# EAGLE design 8_Relay_Buzz_SCT013_75 (EAGLE 7.7.0)
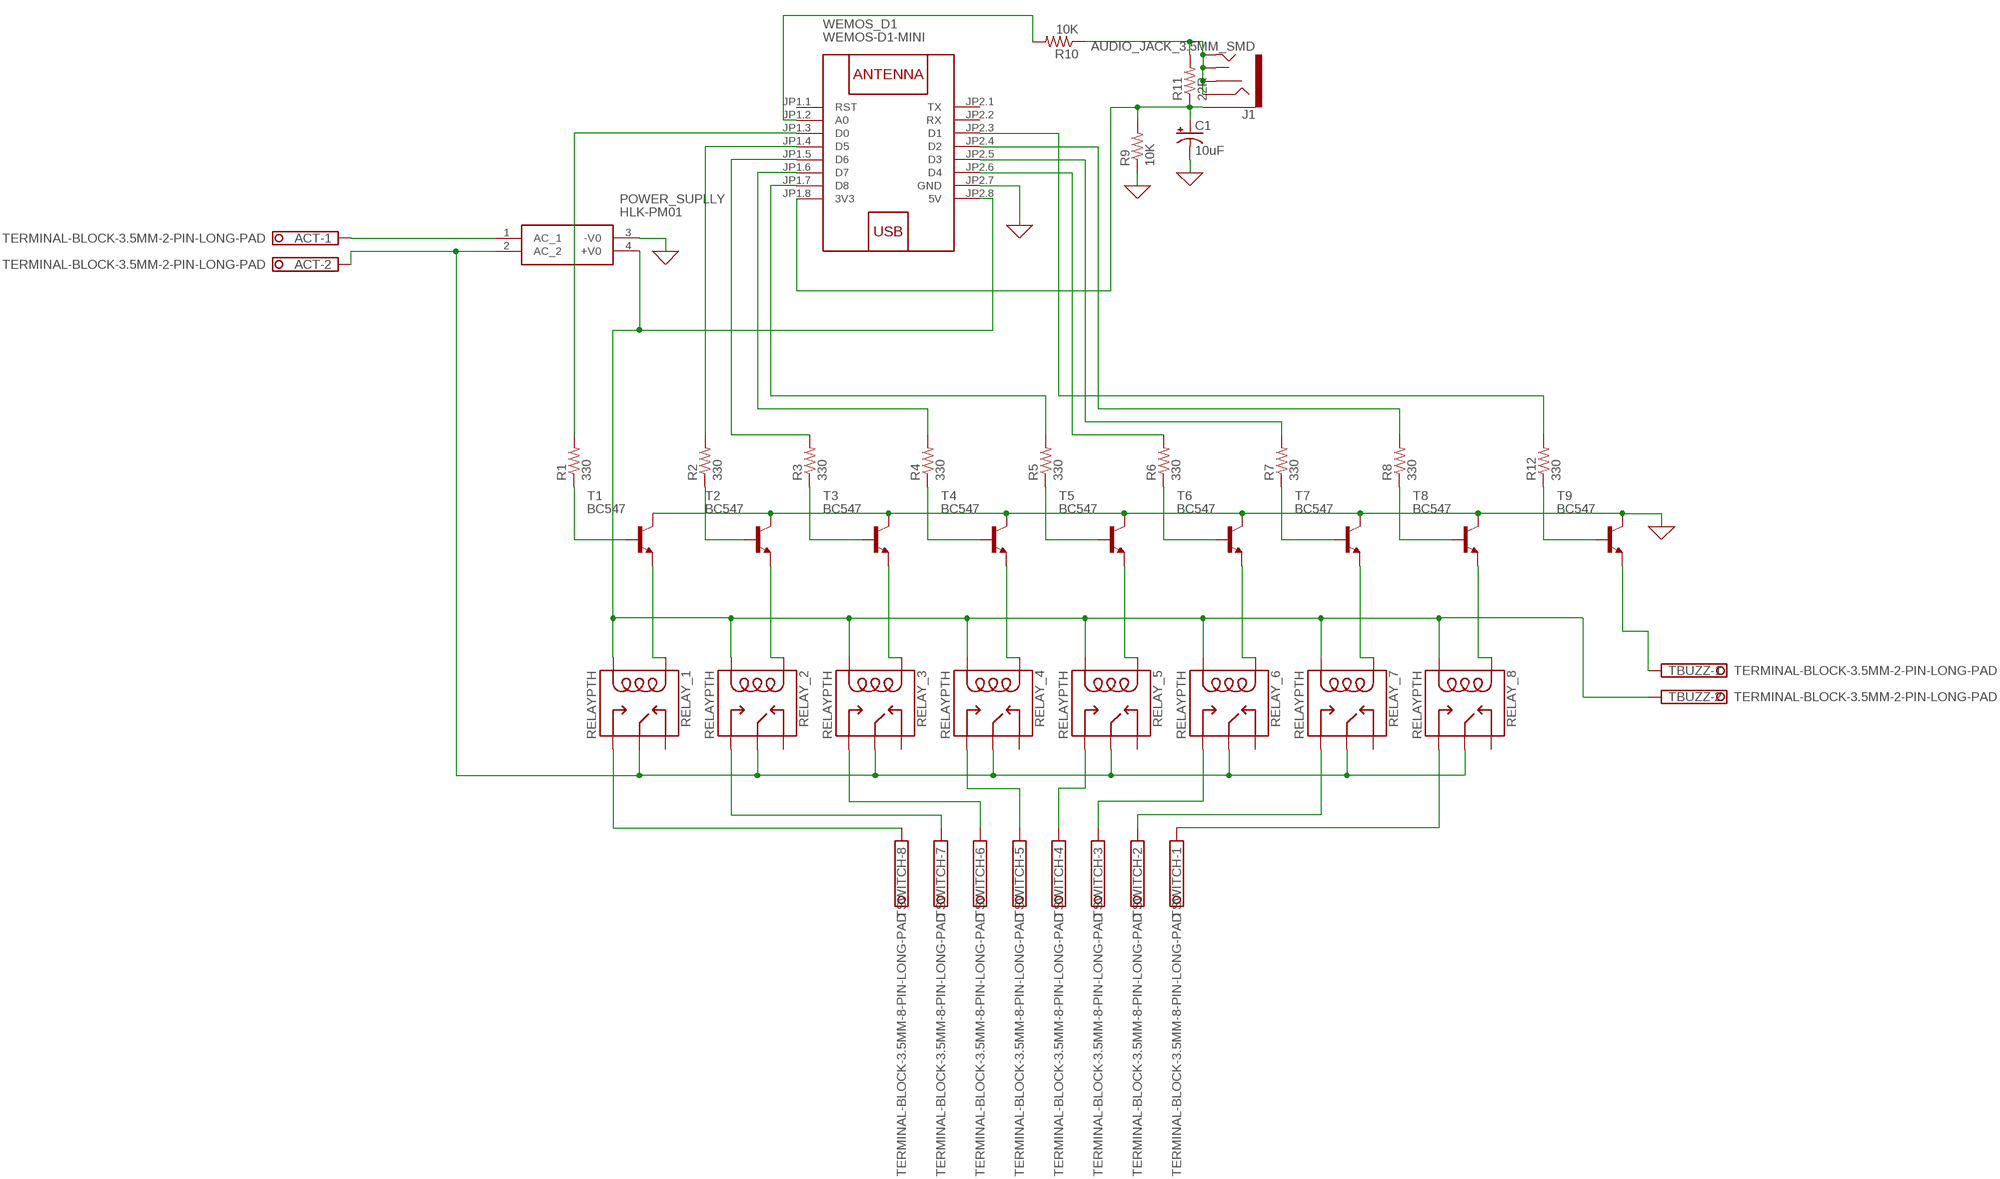
[diagram p0: schematic, sheet 1]

## Parts
ACT  TERMINAL-BLOCK-3.5MM-2-PIN-LONG-PAD  [TERMINAL-BLOCK-2-PIN-3.5MM-LONG-PAD]
C1  10uF  CPOL-USE3.5-8  [E3,5-8]
J1  AUDIO_JACK_3.5MM_SMD  [AUDIO-JACK-3.5MM-SMD]
POWER_SUPLLY  HLK-PM01  [HLKPM01]
R1  330  R-US_0207/5V  [0207/5V]
R2  330  R-US_0207/5V  [0207/5V]
R3  330  R-US_0207/5V  [0207/5V]
R4  330  R-US_0207/5V  [0207/5V]
R5  330  R-US_0207/5V  [0207/5V]
R6  330  R-US_0207/5V  [0207/5V]
R7  330  R-US_0207/5V  [0207/5V]
R8  330  R-US_0207/5V  [0207/5V]
R9  10K  R-US_0207/5V  [0207/5V]
R10  10K  R-US_0207/5V  [0207/5V]
R11  22R  R-US_0207/5V  [0207/5V]
R12  330  R-US_0207/5V  [0207/5V]
RELAY_1  RELAYPTH  [SRD-05VDC-SL-C]
RELAY_2  RELAYPTH  [SRD-05VDC-SL-C]
RELAY_3  RELAYPTH  [SRD-05VDC-SL-C]
RELAY_4  RELAYPTH  [SRD-05VDC-SL-C]
RELAY_5  RELAYPTH  [SRD-05VDC-SL-C]
RELAY_6  RELAYPTH  [SRD-05VDC-SL-C]
RELAY_7  RELAYPTH  [SRD-05VDC-SL-C]
RELAY_8  RELAYPTH  [SRD-05VDC-SL-C]
T1  BC547  [TO92]
T2  BC547  [TO92]
T3  BC547  [TO92]
T4  BC547  [TO92]
T5  BC547  [TO92]
T6  BC547  [TO92]
T7  BC547  [TO92]
T8  BC547  [TO92]
T9  BC547  [TO92]
TBUZZ  TERMINAL-BLOCK-3.5MM-2-PIN-LONG-PAD  [TERMINAL-BLOCK-2-PIN-3.5MM-LONG-PAD]
TSWITCH  TERMINAL-BLOCK-3.5MM-8-PIN-LONG-PAD  [TERMINAL-BLOCK-8-PIN-3.5MM-LONG-PAD]
WEMOS_D1  WEMOS-D1-MINI  [WEMOS-D1-MINI]

## Nets
0: C1.- POWER_SUPLLY.3(-V0) R9.1 T1.3(C) T2.3(C) T3.3(C) T4.3(C) T5.3(C) T6.3(C) T7.3(C) T8.3(C) T9.3(C) WEMOS_D1.JP2.7(GND) ; supply symbol labelled GND
3V: C1.+ J1.SLEEVE R9.2 R11.1 WEMOS_D1.JP1.8(3V3)
5V: POWER_SUPLLY.4(+V0) RELAY_1.COIL0 RELAY_2.COIL0 RELAY_3.COIL0 RELAY_4.COIL0 RELAY_5.COIL0 RELAY_6.COIL0 RELAY_7.COIL0 RELAY_8.COIL0 TBUZZ.2 WEMOS_D1.JP2.8(5V)
A0: R10.2 WEMOS_D1.JP1.2(A0)
AC+: ACT.2 POWER_SUPLLY.2(AC_2) RELAY_1.SWCOMMON RELAY_2.SWCOMMON RELAY_3.SWCOMMON RELAY_4.SWCOMMON RELAY_5.SWCOMMON RELAY_6.SWCOMMON RELAY_7.SWCOMMON RELAY_8.SWCOMMON
AC-: ACT.1 POWER_SUPLLY.1(AC_1)
BBZ: R12.1 T9.2(B)
BR1: R1.1 T1.2(B)
BR2: R2.1 T2.2(B)
BR3: R3.1 T3.2(B)
BR4: R4.1 T4.2(B)
BR5: R5.1 T5.2(B)
BR6: R6.1 T6.2(B)
BR7: R7.1 T7.2(B)
BR8: R8.1 T8.2(B)
D0: R1.2 WEMOS_D1.JP1.3(D0)
D1: R12.2 WEMOS_D1.JP2.3(D1)
D2: R8.2 WEMOS_D1.JP2.4(D2)
D3: R7.2 WEMOS_D1.JP2.5(D3)
D4: R6.2 WEMOS_D1.JP2.6(D4)
D5: R2.2 WEMOS_D1.JP1.4(D5)
D6: R3.2 WEMOS_D1.JP1.5(D6)
D7: R4.2 WEMOS_D1.JP1.6(D7)
D8: R5.2 WEMOS_D1.JP1.7(D8)
EBZ: T9.1(E) TBUZZ.1
ER1: RELAY_1.COIL1 T1.1(E)
ER2: RELAY_2.COIL1 T2.1(E)
ER3: RELAY_3.COIL1 T3.1(E)
ER4: RELAY_4.COIL1 T4.1(E)
ER5: RELAY_5.COIL1 T5.1(E)
ER6: RELAY_6.COIL1 T6.1(E)
ER7: RELAY_7.COIL1 T7.1(E)
ER8: RELAY_8.COIL1 T8.1(E)
SA0: J1.RING J1.RSH J1.TIP J1.TSH R10.1 R11.2
SR1: RELAY_1.SWOPEN TSWITCH.8
SR2: RELAY_2.SWOPEN TSWITCH.7
SR3: RELAY_3.SWOPEN TSWITCH.6
SR4: RELAY_4.SWOPEN TSWITCH.5
SR5: RELAY_5.SWOPEN TSWITCH.4
SR6: RELAY_6.SWOPEN TSWITCH.3
SR7: RELAY_7.SWOPEN TSWITCH.2
SR8: RELAY_8.SWOPEN TSWITCH.1
Unconnected: RELAY_1.SWCLOSED(SWCLOSE) RELAY_2.SWCLOSED(SWCLOSE) RELAY_3.SWCLOSED(SWCLOSE) RELAY_4.SWCLOSED(SWCLOSE) RELAY_5.SWCLOSED(SWCLOSE) RELAY_6.SWCLOSED(SWCLOSE) RELAY_7.SWCLOSED(SWCLOSE) RELAY_8.SWCLOSED(SWCLOSE) WEMOS_D1.JP1.1(RST) WEMOS_D1.JP2.1(TX) WEMOS_D1.JP2.2(RX)

## Library data of the parts
ACT TBUZZ = Rembrandt:TERMINAL-BLOCK-3.5MM-2-PIN: Terminal Block 3.5mm Pitch: 3,5 mm Number of pins: 2 Created by Rembrandt Electronics www.rembrandtelectronics.com
C1 = rcl:CPOL-US: POLARIZED CAPACITOR, American symbol; SPICEPREFIX: C
J1 = SparkFun-Connectors:AUDIO_JACK_3.5MM: Audio Jack 3.5mm variants of PTH and SMT stereo audio jack with bypass switches. SparkFun Products: SparkFun SparkPunk Sound Kit <[https://www.sparkfun.com/products/11177]> - PTH MP3 Trigger <https://www.sparkfun.com/products/13720> -3.5mm SMD SparkFun PicoBoard <https://www.sparkfun.com/products/11888>- 2.5mm SMD; PROD_ID: CONN-10353
POWER_SUPLLY = HLK-PM01:HLK-PM01: Ultra-compact power module Source: Datasheet <https://datasheet.lcsc.com/szlcsc/1906201102_HI-LINK-HLK-PM03_C209904.pdf>; AVAILABILITY: Unavailable; MF: Hi-link; MP: hlk-pm01; PACKAGE: Package; PRICE: None
R1-R12 = adafruit:R-US_: RESISTOR, American symbol
RELAY_1-RELAY_8 = SRD-05VDC-SL-C:RELAY: SPDT relay (COM-00101)
T1-T9 = transistor:BC547: NPN TRANSISTOR
TSWITCH = Rembrandt:TERMINAL-BLOCK-3.5MM-8-PIN: Terminal Block 3.5mm Pitch: 3,5 mm Number of pins: 8 Created by Rembrandt Electronics www.rembrandtelectronics.com
WEMOS_D1 = diy-modules:WEMOS-D1-MINI: WEMOS D1 mini: Mini Wi-Fi Board based on ESP-8266 device More details can be found here: https://www.wemos.cc/product/d1-mini.html Click here to find device on ebay.com <http://www.ebay.com/sch/wemos+d1+mini+nodemcu>

## Board
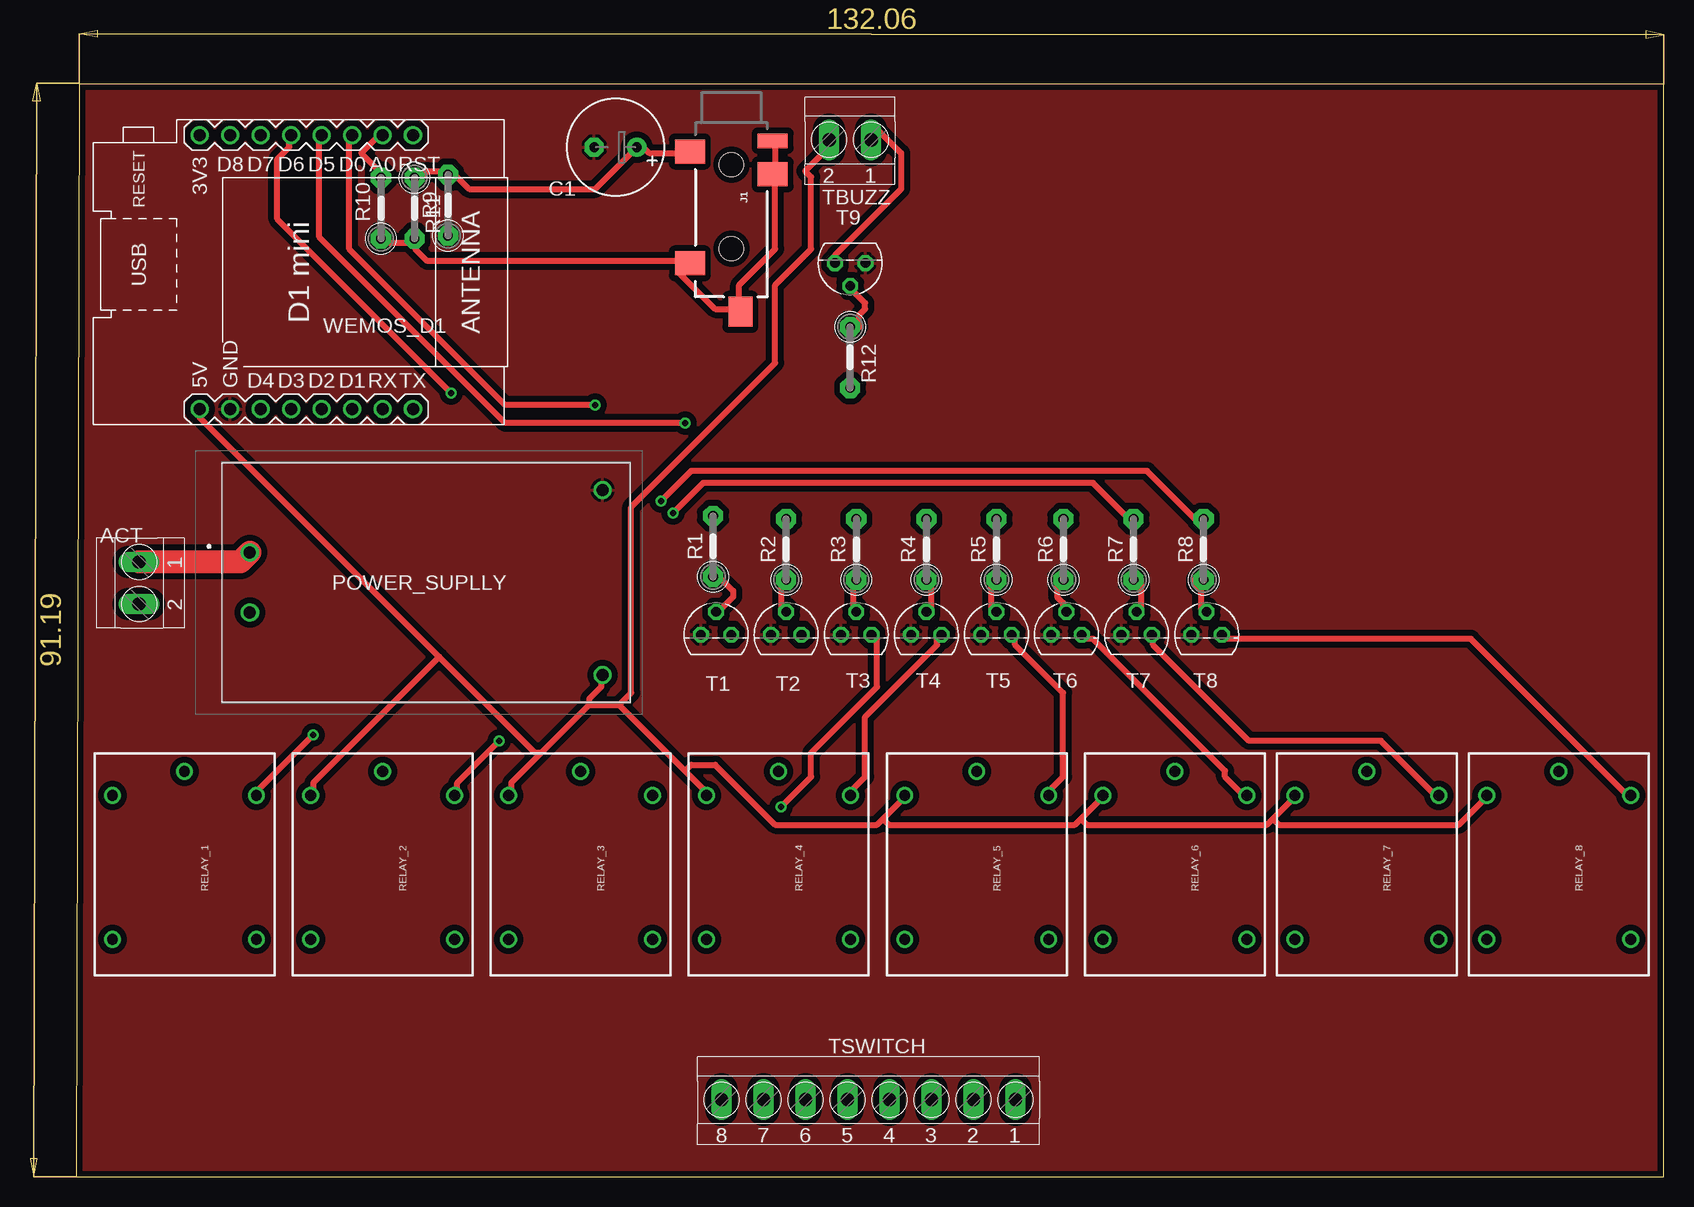
[diagram p1: board, top side]
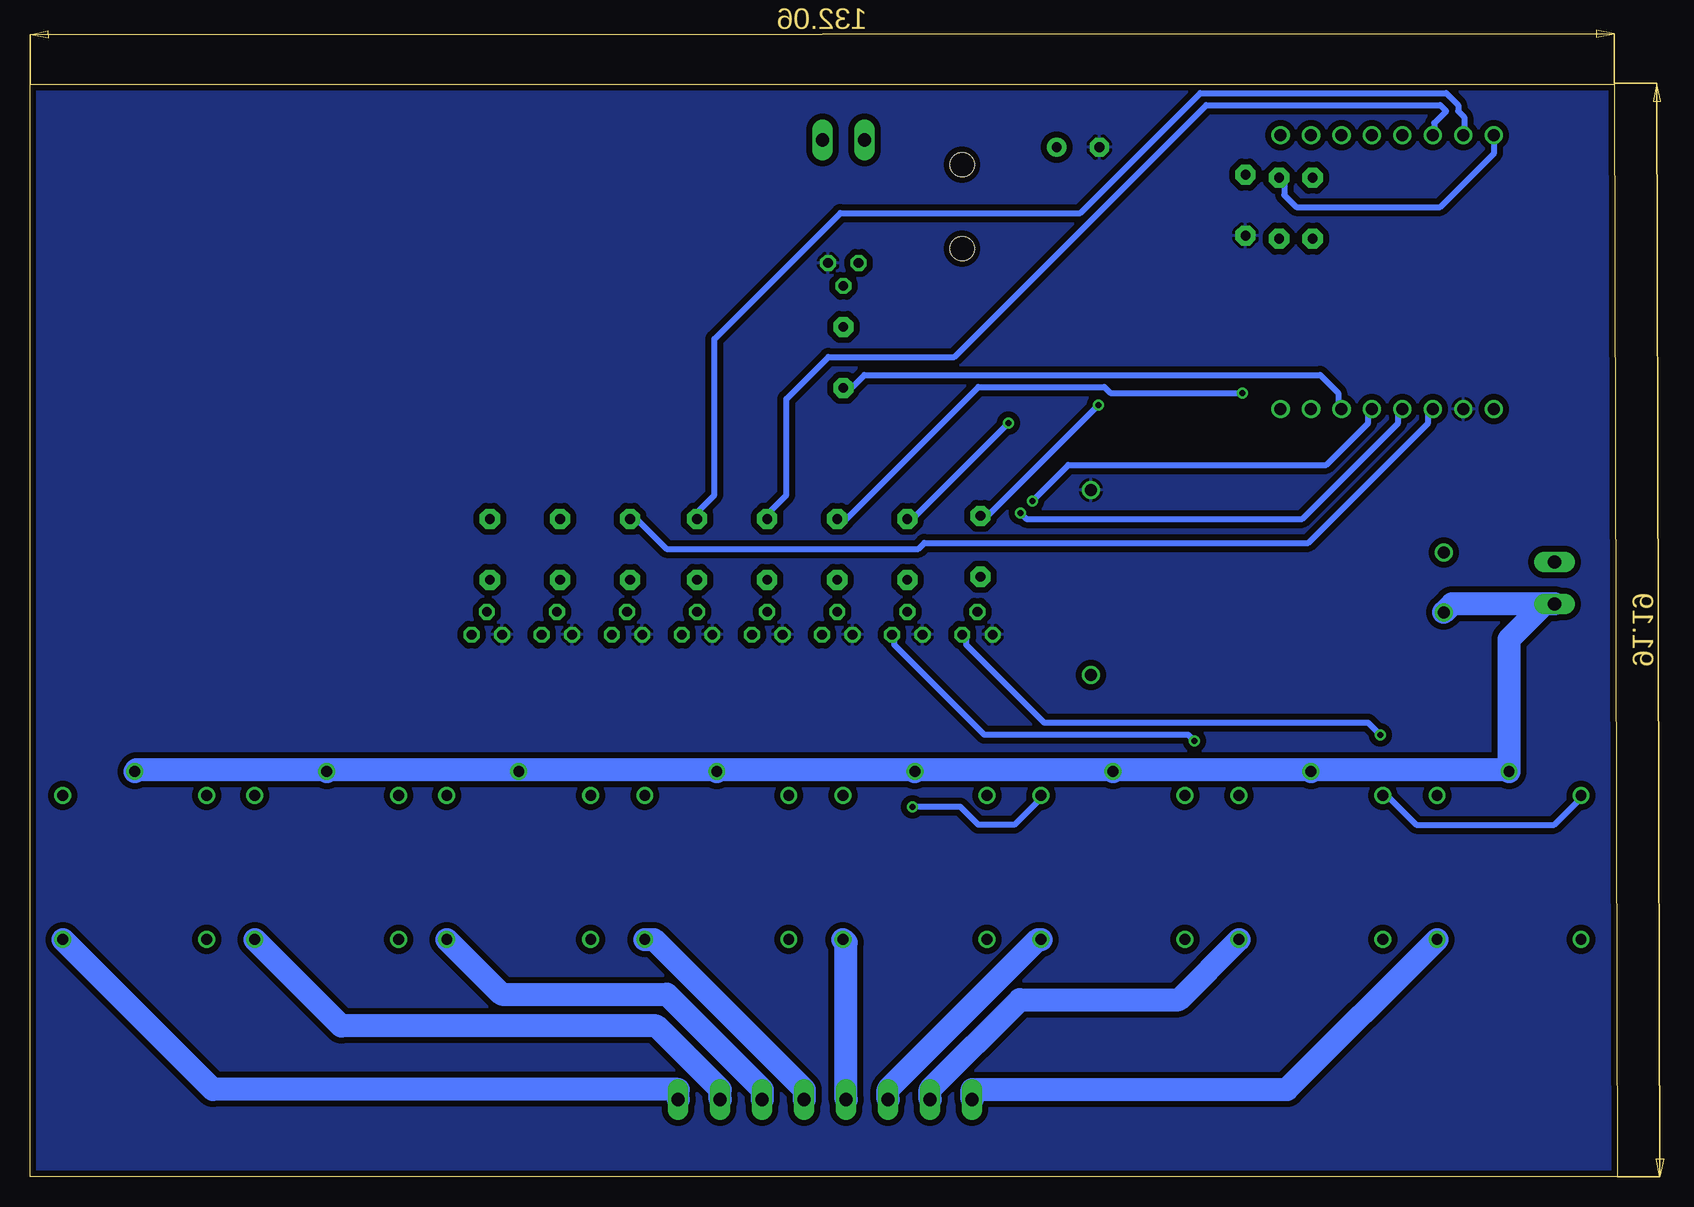
[diagram p2: board, bottom side, seen from below]

Size 132.31 x 91.11 mm. Coordinates in mm from the lower left corner, seen from the top.
Outline: 0,0 132.31,0 132.31,91.11 0.25,91.11 0,0
Copper layers (1*16): Top 0.035mm / dielectric 1.5mm / Bottom 0.035mm
Design rules "default *": minimum track width 0.5mm, minimum drill 0.5mm, track to track 0.5mm, track to pad 0.5mm, pad to pad 0.5mm, via to via 0.5mm, smd to smd 0.5mm, copper to edge 0.5mm, drill to drill 0.5mm, minimum pad ring 10mil, minimum via ring 8mil, stop-mask expansion 0.5mm, vias tented up to drill 0mil, thermal gap 10mil

### Footprints (pad centres in the part's own frame; a part is rotated, then mirrored left to right if it is on the bottom)
TERMINAL-BLOCK-2-PIN-3.5MM-LONG-PAD = drill 1.1 pad 1.7 long: 1 -1.75,-0.1; 2 1.75,-0.1
E3,5-8 = drill 0.813 pad 1.6: + -1.778,0 | drill 0.813 pad 1.6 octagon: - 1.778,0
AUDIO-JACK-3.5MM-SMD = smd 2 x 2.5: RING 4.3,3.45; SLEEVE 2.4,-3.45; TIP 11.7,-3.45 | smd 1.2 x 2.5: RSH 1.5,3.45 | smd 2.5 x 2: TSH 15.75,0.75 | hole 2: 3.5,0; 10.5,0
HLKPM01 = drill 1 pad 1.5: 1 0,0; 2 0,-5; 3 29.4,5.2; 4 29.4,-10.2
0207/5V = drill 0.813 pad 1.676 octagon: 1 -2.54,0; 2 2.54,0
SRD-05VDC-SL-C = drill 0.9: COIL0 -5.39,-6.12; COIL1 -5.39,5.88; SWCLOSED 6.61,-6.12; SWCOMMON -7.39,-0.12; SWOPEN 6.61,5.88
TO92 = drill 0.813 octagon: 1 1.27,0; 2 0,1.905; 3 -1.27,0
TERMINAL-BLOCK-8-PIN-3.5MM-LONG-PAD = drill 1.1 pad 1.7 long: 1 -12.25,-0.1; 2 -8.75,-0.1; 3 -5.25,-0.1; 4 -1.75,-0.1; 5 1.75,-0.1; 6 5.25,-0.1; 7 8.75,-0.1; 8 12.25,-0.1
WEMOS-D1-MINI = drill 1: JP1.1 -11.43,9.525; JP1.2 -11.43,6.985; JP1.3 -11.43,4.445; JP1.4 -11.43,1.905; JP1.5 -11.43,-0.635; JP1.6 -11.43,-3.175; JP1.7 -11.43,-5.715; JP1.8 -11.43,-8.255; JP2.1 11.43,9.525; JP2.2 11.43,6.985; JP2.3 11.43,4.445; JP2.4 11.43,1.905; JP2.5 11.43,-0.635; JP2.6 11.43,-3.175; JP2.7 11.43,-5.715; JP2.8 11.43,-8.255

### Placement (x,y rotation side)
ACT  5.33,49.53 270 top
C1  44.96,85.85 180 top
J1  54.61,87.88 270 top
POWER_SUPLLY  14.48,52.07 0 top
R1  53.09,52.58 90 top
R2  59.18,52.32 90 top
R3  65.02,52.32 90 top
R4  70.87,52.32 90 top
R5  76.71,52.32 90 top
R6  82.3,52.32 90 top
R7  88.14,52.32 90 top
R8  93.98,52.32 90 top
R9  30.99,81.03 90 top
R10  25.4,80.77 90 top
R11  28.19,80.77 270 top
R12  64.52,68.33 270 top
RELAY_1  9.14,26.42 270 top
RELAY_2  25.65,26.42 270 top
RELAY_3  42.16,26.42 270 top
RELAY_4  58.67,26.42 270 top
RELAY_5  75.18,26.42 270 top
RELAY_6  91.69,26.42 270 top
RELAY_7  107.7,26.42 270 top
RELAY_8  123.7,26.42 270 top
T1  53.34,45.21 0 top
T2  59.18,45.21 0 top
T3  65.02,45.21 0 top
T4  70.87,45.21 0 top
T5  76.71,45.21 0 top
T6  82.55,45.21 0 top
T7  88.39,45.21 0 top
T8  94.23,45.21 0 top
T9  64.52,76.2 180 top
TBUZZ  64.52,86.36 180 top
TSWITCH  66.04,6.35 180 top
WEMOS_D1  18.54,75.44 270 top

### Tracks (layer width: path | path; a pad name or v marks a point on that pad's centre or on a via)
0
  pour Bottom: 0.25,91.19 132.33,91.19 132.33,0 0.25,0
  pour Top: 0.25,91.19 132.33,91.19 132.33,0 0.25,0
3V
  Top 0.5: J1.SLEEVE 50.75,85.36 47.75,85.36 47.25,85.86 46.75,85.86 C1.+ 46.25,85.36 43.25,82.36 32.75,82.36 31.25,83.86 R9.2 30.75,83.86 29.25,83.86 28.25,82.86 R11.1
  Bottom 0.5: WEMOS_D1.JP1.8 10.25,86.86 10.25,85.36 14.75,80.86 26.75,80.86 27.75,81.86 27.75,82.86 R11.1
5V
  Top 0.5: 42.75,39.36 38.75,35.36 | 38.75,35.36 36.25,32.86 36.25,31.86 RELAY_3.COIL0 | 42.75,39.36 42.75,39.86 43.75,40.86 43.75,41.86 POWER_SUPLLY.4 | 45.25,39.36 50.75,33.86 | 50.75,33.86 52.25,32.36 52.25,31.86 RELAY_4.COIL0 | 42.75,39.36 45.25,39.36 | 67.25,29.86 66.75,29.36 58.25,29.36 53.25,34.36 51.25,34.36 50.75,33.86 | 67.25,29.86 68.75,31.36 RELAY_5.COIL0 | 83.75,29.86 83.25,29.36 67.75,29.36 67.25,29.86 | 83.75,29.86 85.25,31.36 RELAY_6.COIL0 | 99.75,29.86 99.25,29.36 84.25,29.36 83.75,29.86 | 99.75,29.86 101.25,31.36 RELAY_7.COIL0 | 99.75,29.86 100.25,29.36 115.25,29.36 117.25,31.36 RELAY_8.COIL0 | 30.25,43.36 38.25,35.36 38.75,35.36 | 30.25,43.36 10.25,63.36 10.25,63.86 WEMOS_D1.JP2.8 | 45.25,39.36 46.25,40.36 46.25,55.86 58.25,67.86 58.25,74.36 61.25,77.36 61.25,83.36 60.75,83.86 62.75,85.86 62.75,86.36 TBUZZ.2 | 30.25,43.36 19.75,32.86 19.75,31.86 RELAY_2.COIL0
  Bottom 0.5: RELAY_1.COIL0 3.25,31.36 5.25,29.36 16.75,29.36 19.25,31.86 RELAY_2.COIL0
A0
  Top 0.5: WEMOS_D1.JP1.2 25.25,86.86 23.75,85.36 25.75,83.36 R10.2
AC+
  Bottom 0.5: RELAY_6.SWCOMMON 91.75,33.86 91.75,33.96
  Bottom 1.905: 6.08,47.78 9.02,44.84 RELAY_1.SWCOMMON 9.18,33.96 25.38,33.96 RELAY_2.SWCOMMON 25.69,33.96 41.89,33.96 RELAY_3.SWCOMMON 42.2,33.96 58.4,33.96 RELAY_4.SWCOMMON 58.71,33.96 74.91,33.96 RELAY_5.SWCOMMON 75.22,33.96 91.75,33.96 107.42,33.96 RELAY_7.SWCOMMON 107.73,33.96 123.42,33.96 RELAY_8.SWCOMMON | ACT.2 6.08,47.78 | 6.08,47.78 13.77,47.78 POWER_SUPLLY.2
AC-
  Top 1.905: POWER_SUPLLY.1 13.69,51.28 ACT.1
BBZ
  Top 0.5: T9.2 64.75,73.86 65.75,72.86 65.75,72.36 65.25,71.86 65.25,70.86 64.75,70.36 64.25,70.86 R12.1
BR1
  Top 0.5: T1.2 53.75,47.36 54.75,48.36 54.75,48.86 53.25,50.36 R1.1
BR2
  Top 0.5: T2.2 58.75,47.36 58.75,49.36 R2.1
BR3
  Top 0.5: T3.2 64.75,47.36 64.75,49.36 R3.1
BR4
  Top 0.5: T4.2 71.25,47.36 71.25,49.36 R4.1
BR5
  Top 0.5: T5.2 76.25,47.36 76.25,49.36 R5.1
BR6
  Top 0.5: T6.2 82.25,47.36 82.25,47.86 81.75,48.36 81.75,49.86 82.25,49.86 R6.1
BR7
  Top 0.5: T7.2 88.75,47.36 88.75,49.86 88.25,50.36 87.75,49.86 R7.1
BR8
  Top 0.5: T8.2 93.75,47.36 93.75,48.86 93.25,49.36 93.25,49.86 93.75,50.36 94.25,49.86 R8.1
D0  (via drill 0.5)
  Top 0.5: v43.25,64.36 35.75,64.36 22.75,77.36 22.75,86.86 WEMOS_D1.JP1.3
  Bottom 0.5: v43.25,64.36 52.75,54.86 R1.2
D1
  Bottom 0.5: WEMOS_D1.JP2.3 23.25,64.36 23.25,65.36 24.75,66.86 62.75,66.86 63.75,65.86 64.25,66.36 64.75,66.36 64.75,65.86 R12.2
D2  (via drill 0.5)
  Top 0.5: v48.75,56.36 51.25,58.86 89.25,58.86 93.75,54.36 94.25,54.86 R8.2
  Bottom 0.5: v48.75,56.36 45.75,59.36 24.25,59.36 20.75,62.86 20.75,63.86 WEMOS_D1.JP2.4
D3  (via drill 0.5)
  Top 0.5: v49.75,55.36 52.25,57.86 84.75,57.86 87.75,54.86 R7.2
  Bottom 0.5: v49.75,55.36 49.25,54.86 26.25,54.86 18.25,62.86 18.25,63.86 WEMOS_D1.JP2.5
D4
  Bottom 0.5: WEMOS_D1.JP2.6 15.75,63.86 15.75,62.86 25.75,52.86 57.75,52.86 58.25,52.36 79.25,52.36 82.25,55.36 R6.2
D5  (via drill 0.5)
  Top 0.5: v50.75,62.86 35.75,62.86 20.25,78.36 20.25,86.86 WEMOS_D1.JP1.4
  Bottom 0.5: v50.75,62.86 58.75,54.86 R2.2
D6  (via drill 0.5)
  Top 0.5: v31.25,65.36 16.75,79.86 16.75,84.86 17.75,85.86 17.75,86.86 WEMOS_D1.JP1.5
  Bottom 0.5: v31.25,65.36 42.25,65.36 42.75,65.86 53.25,65.86 64.75,54.36 65.25,54.86 R3.2
D7
  Bottom 0.5: WEMOS_D1.JP1.6 15.25,87.36 15.25,87.86 14.25,88.86 14.75,89.36 34.25,89.36 55.25,68.36 65.75,68.36 69.25,64.86 69.25,56.86 70.75,55.36 R4.2
D8
  Bottom 0.5: WEMOS_D1.JP1.7 12.75,87.36 12.75,88.36 13.25,88.86 13.25,89.36 14.25,90.36 34.75,90.36 44.75,80.36 64.75,80.36 75.25,69.86 75.25,56.86 76.75,55.36 R5.2
EBZ
  Top 0.5: T9.1 63.25,76.36 63.25,76.86 68.75,82.36 68.75,85.36 66.75,87.36 66.25,86.86 TBUZZ.1
ER1  (via drill 0.5)
  Top 0.5: v19.75,36.86 14.75,31.86 RELAY_1.COIL1
  Bottom 0.5: v19.75,36.86 20.75,37.86 47.75,37.86 54.25,44.36 54.25,44.86 T1.1
ER2  (via drill 0.5)
  Top 0.5: v35.25,36.36 31.75,32.86 31.75,31.86 RELAY_2.COIL1
  Bottom 0.5: v35.25,36.36 35.75,36.86 52.75,36.86 60.25,44.36 60.25,44.86 T2.1
ER3  (via drill 0.5)
  Top 0.5: v58.75,30.86 61.25,33.36 61.25,35.36 66.75,40.86 66.75,44.86 T3.1
  Bottom 0.5: v58.75,30.86 54.75,30.86 53.25,29.36 50.25,29.36 48.25,31.36 RELAY_3.COIL1
ER4
  Top 0.5: T4.1 71.75,44.86 71.75,44.36 65.75,38.36 65.75,33.36 64.25,31.86 RELAY_4.COIL1
ER5
  Top 0.5: T5.1 78.25,44.86 78.25,44.36 82.25,40.36 82.25,33.36 80.75,31.86 RELAY_5.COIL1
ER6
  Top 0.5: T6.1 84.25,44.86 84.75,44.86 95.75,33.86 95.75,33.36 97.25,31.86 RELAY_6.COIL1
ER7
  Top 0.5: T7.1 89.75,44.86 89.75,44.36 97.75,36.36 108.75,36.36 113.25,31.86 RELAY_7.COIL1
ER8
  Top 0.5: T8.1 95.75,44.86 116.25,44.86 129.25,31.86 RELAY_8.COIL1
SA0
  Top 0.5: R10.1 25.75,77.86 27.75,77.86 R11.2 28.25,77.86 28.25,77.36 29.25,76.36 50.75,76.36 | J1.RSH 58.25,86.36 58.25,83.86 J1.RING 58.25,83.36 58.25,77.36 55.25,74.36 55.25,72.36 | 55.25,72.36 53.25,72.36 50.25,75.36 50.25,75.86 50.75,76.36 | 55.25,72.36 J1.TSH | 50.75,76.36 J1.TIP
SR1
  Bottom 1.905: TSWITCH.8 53.79,7.3 27.53,7.3 RELAY_1.SWOPEN
SR2
  Bottom 1.905: TSWITCH.7 57.29,7.3 49.81,14.78 36.56,14.78 RELAY_2.SWOPEN
SR3
  Bottom 1.905: TSWITCH.6 60.79,7.3 48.28,19.81 RELAY_3.SWOPEN
SR4
  Bottom 1.905: TSWITCH.5 64.29,19.54 RELAY_4.SWOPEN
SR5
  Bottom 1.905: RELAY_5.SWOPEN 80.3,19.81 67.79,7.3 TSWITCH.4
SR6
  Bottom 1.905: RELAY_6.SWOPEN 93,15.23 79.22,15.23 71.29,7.3 TSWITCH.3
SR7
  Bottom 1.905: TSWITCH.2 74.79,7.3 80.09,12.6 106.37,12.6 RELAY_7.SWOPEN
SR8
  Bottom 1.905: TSWITCH.1 78.29,7.3 117.07,7.3 RELAY_8.SWOPEN

### Text on the board
tValues: 8_Wemos D1 Mini_Relay_SCT013 V1.0 | By Techkom